# EAGLE design gameboy-pocket (EAGLE 8.5.0)
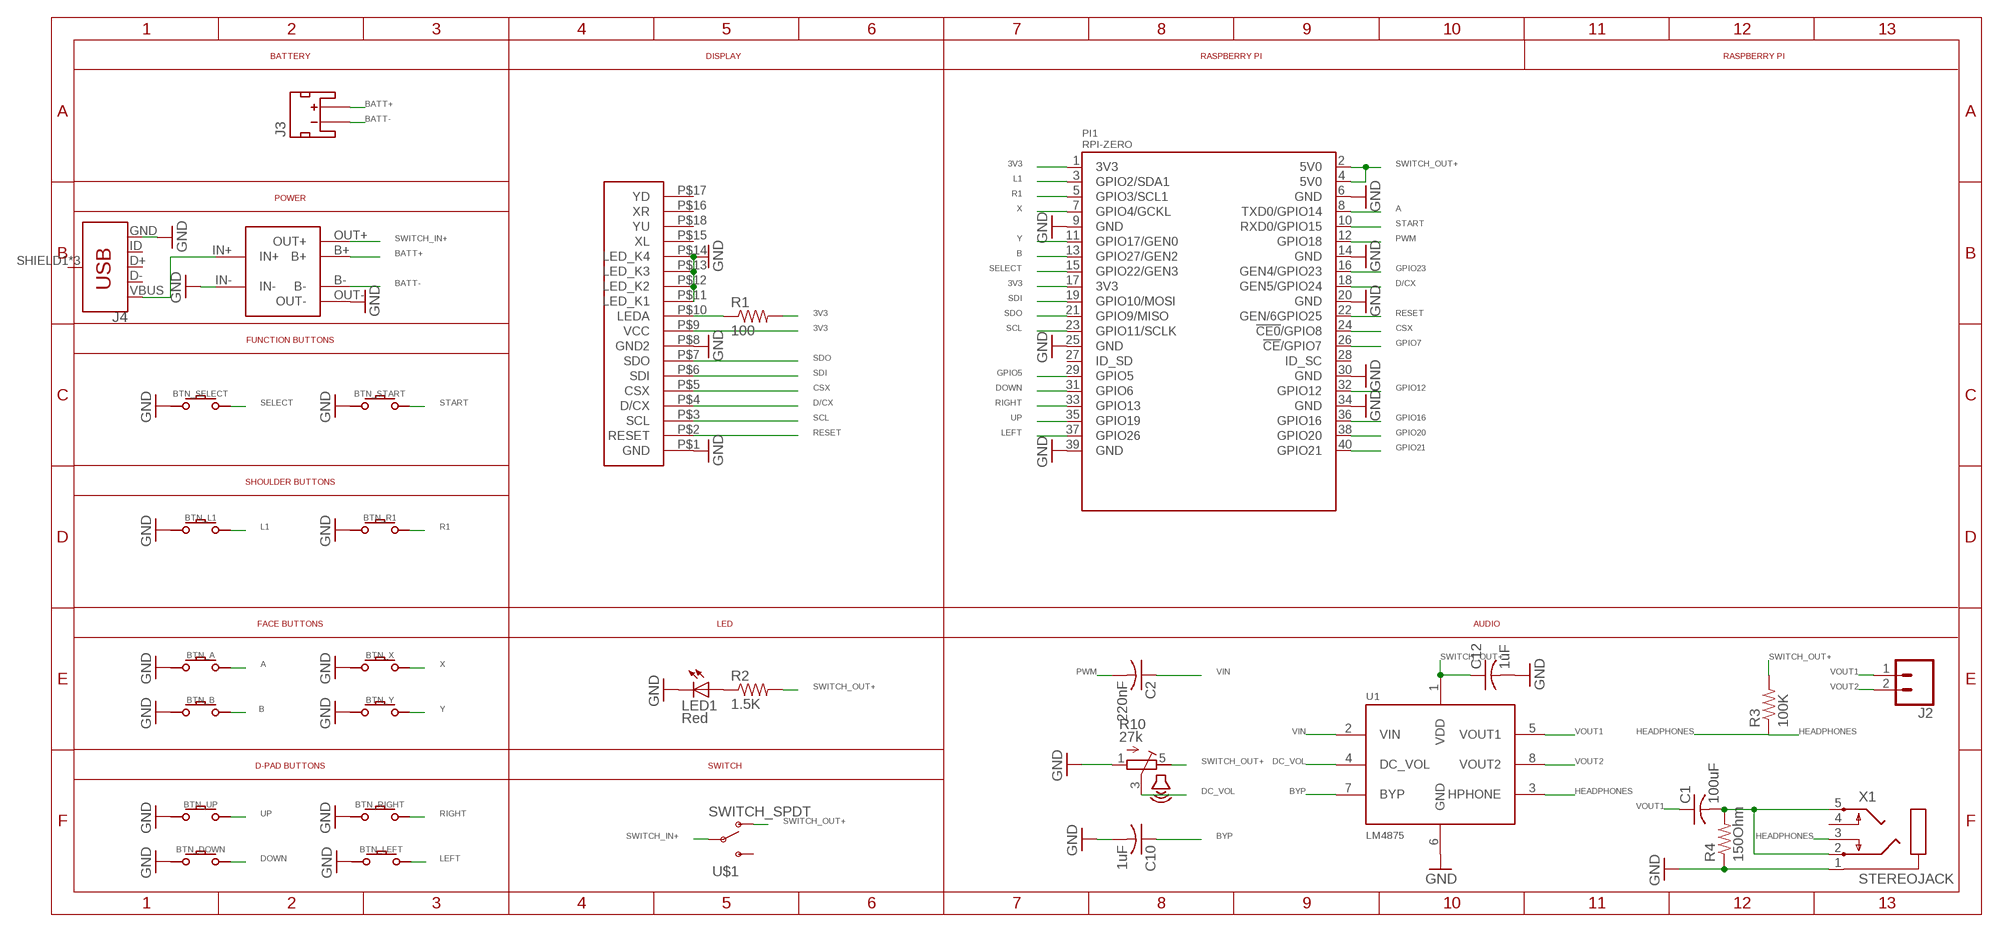
[diagram p0: schematic, sheet 1]

## Parts
2.4"TFT-ILI9341  GAMEBOYZEROHANDHELDDISPLAYS-2.4  [GAMEBOYZEROHANDHELDDISPLAYS-2.4]
BTN_A  GAMEBOY-ZERO-BUTTON  [GAMEBOY-ZERO-BUTTON]
BTN_B  GAMEBOY-ZERO-BUTTON  [GAMEBOY-ZERO-BUTTON]
BTN_DOWN  GAMEBOY-ZERO-BUTTON  [GAMEBOY-ZERO-BUTTON]
BTN_L1  GAMEBOY-ZERO-BUTTON  [GAMEBOY-ZERO-BUTTON]
BTN_LEFT  GAMEBOY-ZERO-BUTTON  [GAMEBOY-ZERO-BUTTON]
BTN_R1  GAMEBOY-ZERO-BUTTON  [GAMEBOY-ZERO-BUTTON]
BTN_RIGHT  GAMEBOY-ZERO-BUTTON  [GAMEBOY-ZERO-BUTTON]
BTN_SELECT  GAMEBOY-ZERO-BUTTON  [GAMEBOY-ZERO-BUTTON]
BTN_START  GAMEBOY-ZERO-BUTTON  [GAMEBOY-ZERO-BUTTON]
BTN_UP  GAMEBOY-ZERO-BUTTON  [GAMEBOY-ZERO-BUTTON]
BTN_X  GAMEBOY-ZERO-BUTTON  [GAMEBOY-ZERO-BUTTON]
BTN_Y  GAMEBOY-ZERO-BUTTON  [GAMEBOY-ZERO-BUTTON]
C1  100uF  C-USC0805  [C0805]
C2  220nF  C-USC0805  [C0805]
C10  1uF  C-USC0805  [C0805]
C12  1uF  C-USC0805  [C0805]
J2  CONN_02  [1X02]
J3  JST_2MM_MALE  [JST-2-SMD]
J4  USB_MICRO-B_FEMALE-SMT  [USB-B-MICRO-SMD]
LED1  Red  LEDCHIPLED_0805  [CHIPLED_0805]
PI1  RPI-ZERO  [RASPBERRYPI_BASTELSTUBE_V13_RASPI_BOARD_B+_FULL]
POWER1  03962A  [03962A]
R1  100  R-US_R0805  [R0805]
R2  1.5K  R-US_R0805  [R0805]
R3  100K  R-US_R0805  [R0805]
R4  150Ohm  R-US_R0805  [R0805]
R10  27k  VOLUME  [VOLUME]
U1  LM4875  [SOIC8]
U$1  SWITCH_SPDT  [KPS-1290]
X1  STEREOJACK  [STX3100]

## Nets
3V3: 2.4"TFT-ILI9341.P$9(VCC) PI1.1(3V3) PI1.17(3V3) R1.2
3V3100OHM: 2.4"TFT-ILI9341.P$10(LEDA) R1.1
A: BTN_A.P$ACTIVE PI1.8(TXD0/GPIO14)
B: BTN_B.P$ACTIVE PI1.13(GPIO27/GEN2)
BATT+: J3.2(+) POWER1.B+
BATT-: J3.1(-) POWER1.B-
BYP: C10.1 U1.7(BYP)
CSX: 2.4"TFT-ILI9341.P$5(CSX) PI1.24(!CE0!/GPIO8)
D/CX: 2.4"TFT-ILI9341.P$4(D/CX) PI1.18(GEN5/GPIO24)
DC_VOL: R10.3(S) U1.4(DC_VOL)
DOWN: BTN_DOWN.P$ACTIVE PI1.31(GPIO6)
GND: 2.4"TFT-ILI9341.P$1(GND) 2.4"TFT-ILI9341.P$8(GND2) 2.4"TFT-ILI9341.P$11(LED_K1) 2.4"TFT-ILI9341.P$12(LED_K2) 2.4"TFT-ILI9341.P$13(LED_K3) 2.4"TFT-ILI9341.P$14(LED_K4) BTN_A.P$GND BTN_B.P$GND BTN_DOWN.P$GND BTN_L1.P$GND BTN_LEFT.P$GND BTN_R1.P$GND BTN_RIGHT.P$GND BTN_SELECT.P$GND BTN_START.P$GND BTN_UP.P$GND BTN_X.P$GND BTN_Y.P$GND C10.2 C12.2 J4.GND LED1.C PI1.6(GND) PI1.9(GND) PI1.14(GND) PI1.20(GND) PI1.25(GND) PI1.30(GND) PI1.34(GND) PI1.39(GND) POWER1.IN- POWER1.OUT- R4.1 R10.1(A) U1.6(GND) X1.1
GPIO5: PI1.29(GPIO5)
GPIO7: PI1.26(!CE!/GPIO7)
GPIO12: PI1.32(GPIO12)
GPIO16: PI1.36(GPIO16)
GPIO20: PI1.38(GPIO20)
GPIO21: PI1.40(GPIO21)
GPIO23: PI1.16(GEN4/GPIO23)
HEADPHONES: R3.1 U1.3(HPHONE) X1.3
L1: BTN_L1.P$ACTIVE PI1.3(GPIO2/SDA1)
LED: LED1.A R2.1
LEFT: BTN_LEFT.P$ACTIVE PI1.37(GPIO26)
PWM: C2.2 PI1.12(GPIO18)
R1: BTN_R1.P$ACTIVE PI1.5(GPIO3/SCL1)
RESET: 2.4"TFT-ILI9341.P$2(RESET) PI1.22(GEN/6GPIO25)
RIGHT: BTN_RIGHT.P$ACTIVE PI1.33(GPIO13)
SCL: 2.4"TFT-ILI9341.P$3(SCL) PI1.23(GPIO11/SCLK)
SDI: 2.4"TFT-ILI9341.P$6(SDI) PI1.19(GPIO10/MOSI)
SDO: 2.4"TFT-ILI9341.P$7(SDO) PI1.21(GPIO9/MISO)
SELECT: BTN_SELECT.P$ACTIVE PI1.15(GPIO22/GEN3)
START: BTN_START.P$ACTIVE PI1.10(RXD0/GPIO15)
SWITCH_IN+: POWER1.OUT+ U$1.P
SWITCH_OUT+: C12.1 PI1.2(5V0) PI1.4(5V0) R2.2 R3.2 R10.5(E) U1.1(VDD) U$1.O
UP: BTN_UP.P$ACTIVE PI1.35(GPIO19)
VIN: C2.1 U1.2(VIN)
VIN1: C1.2 R4.2 X1.2 X1.5
VOUT1: C1.1 J2.1 U1.5(VOUT1)
VOUT2: J2.2 U1.8(VOUT2)
VUSB: J4.VBUS POWER1.IN+
X: BTN_X.P$ACTIVE PI1.7(GPIO4/GCKL)
Y: BTN_Y.P$ACTIVE PI1.11(GPIO17/GEN0)
Unconnected: 2.4"TFT-ILI9341.P$15(XL) 2.4"TFT-ILI9341.P$16(XR) 2.4"TFT-ILI9341.P$17(YD) 2.4"TFT-ILI9341.P$18(YU) J3.NC1(PAD1) J3.NC2(PAD2) J4.D+ J4.D- J4.ID J4.SHIELD1(SHIELD) J4.SHIELD2(SHIELD) J4.SHIELD3(SHIELD) PI1.27(ID_SD) PI1.28(ID_SC) U$1.S X1.4

## Notes on the sheet
- BATTERY | DISPLAY | RASPBERRY PI | RASPBERRY PI
- POWER
- FUNCTION BUTTONS
- SHOULDER BUTTONS
- FACE BUTTONS | LED | AUDIO
- D-PAD BUTTONS | SWITCH

## Library data of the parts
2.4"TFT-ILI9341 = GameboyZeroHandheldDisplays:GAMEBOYZEROHANDHELDDISPLAYS-2.4
BTN_A BTN_B BTN_DOWN BTN_L1 BTN_LEFT BTN_R1 BTN_RIGHT BTN_SELECT BTN_START BTN_UP BTN_X BTN_Y = GameboyZeroButtonLibrary:GAMEBOY-ZERO-BUTTON
C1 C2 C10 C12 = adafruit:C-US: CAPACITOR, American symbol
J2 = SparkFun-Connectors:CONN_02: Multi connection point. Often used as Generic Header-pin footprint for 0.1 inch spaced/style header connections On any of the 0.1 inch spaced packages, you can populate with these: Break Away Headers - Straight <https://www.sparkfun.com/products/116> (PRT-00116) Break Away Male Headers - Right Angle <https://www.sparkfun.com/products/553> (PRT-00553) Female Headers <https://www.sparkfun.com/products/115> (PRT-00115) Break Away Headers - Machine Pin <https://www.sparkfun.com/products/117> (PRT-00117) Break Away Female Headers - Swiss Machine Pin <https://www.sparkfun.com/products/743> (PRT-00743) For SCREWTERMINALS and SPRING TERMINALS visit here: Screw Terimnals on SparkFun.com <https://www.sparkfun.com/search/results?term=Screw+Terminals> (5mm/3.5mm/2.54mm spacing) This device is also useful as a general connection point to wire up your design to another part of your project. Our various solder wires solder well into these plated through hole pads. Hook-Up Wire - Assortment (Stranded, 22 AWG) <https://www.sparkfun.com/products/11375> (PRT-11375) Hook-Up Wire - Assortment (Solid Core, 22 AWG) <https://www.sparkfun.com/products/11367> (PRT-11367) View the entire wire category on our website here <https://www.sparkfun.com/categories/141> Special notes: Molex polarized connector foot print use with: PRT-08233 with associated crimp pins and housings. 2.54_SCREWTERM for use with PRT-10571. 3.5mm Screw Terminal footprints for PRT-08084 5mm Screw Terminal footprints for use with PRT-08432
J3 = SparkFun-Connectors:JST_2MM_MALE: Mates to single-cell LiPo batteries. CONN-11443 Now with smashable polarity marks!; BTM_NEG: -; BTM_POS: +; PROD_ID: CONN-11443; TOP_NEG: -; TOP_POS: +
J4 = SparkFun-Connectors:USB_MICRO-B: USB Type Micro-B Connector Male/female and PTH/SMT variants SparkFun Products: SparkFun microB USB Breakout <https://www.sparkfun.com/products/12035> SparkFun USB microB Plug Breakout <https://www.sparkfun.com/products/10031> SparkFun ESP8266 Thing <https://www.sparkfun.com/products/13231>; PROD_ID: CONN-11752
LED1 = adafruit:LED: LED OSRAM: - CHIPLED LG R971, LG N971, LY N971, LG Q971, LY Q971, LO R971, LY R971 LH N974, LH R974 LS Q976, LO Q976, LY Q976 LO Q996 - Hyper CHIPLED LW Q18S LB Q993, LB Q99A, LB R99A - SideLED LS A670, LO A670, LY A670, LG A670, LP A670 LB A673, LV A673, LT A673, LW A673 LH A674 LY A675 LS A676, LA A676, LO A676, LY A676, LW A676 LS A679, LY A679, LG A679 - Hyper Micro SIDELED® LS Y876, LA Y876, LO Y876, LY Y876 LT Y87S - SmartLED LW L88C, LW L88S LB L89C, LB L89S, LG L890 LS L89K, LO L89K, LY L89K LS L896, LA L896, LO L896, LY L896 - TOPLED LS T670, LO T670, LY T670, LG T670, LP T670 LSG T670, LSP T670, LSY T670, LOP T670, LYG T670 LG T671, LOG T671, LSG T671 LB T673, LV T673, LT T673, LW T673 LH T674 LS T676, LA T676, LO T676, LY T676, LB T676, LH T676, LSB T676, LW T676 LB T67C, LV T67C, LT T67C, LS T67K, LO T67K, LY T67K, LW E67C LS E67B, LA E67B, LO E67B, LY E67B, LB E67C, LV E67C, LT E67C LW T67C LS T679, LY T679, LG T679 LS T770, LO T770, LY T770, LG T770, LP T770 LB T773, LV T773, LT T773, LW T773 LH T774 LS E675, LA E675, LY E675, LS T675 LS T776, LA T776, LO T776, LY T776, LB T776 LHGB T686 LT T68C, LB T68C - Hyper Mini TOPLED® LB M676 - Mini TOPLED Santana® LG M470 LS M47K, LO M47K, LY M47K Source: http://www.osram.convergy.de/
PI1 = RPI-Zero:RPI-ZERO
POWER1 = 03962A:03962A
R1-R4 = adafruit:R-US_: RESISTOR, American symbol
R10 = GBA:VOLUME
U1 = texas:LM4875
U$1 = SparkFun-Retired:SWITCH_SPDT: SWCH-10651 Side-actuated SPDT slide switch, as used on the Arduino Pro; PROD_ID: SWCH-10651
X1 = adafruit:STEREOJACK: MIC/HEADPHONE JACK Stereo jack with two switches. Kycon STX3100, CUI SJ1-3555NG and/or 4UCon 05544

## Board
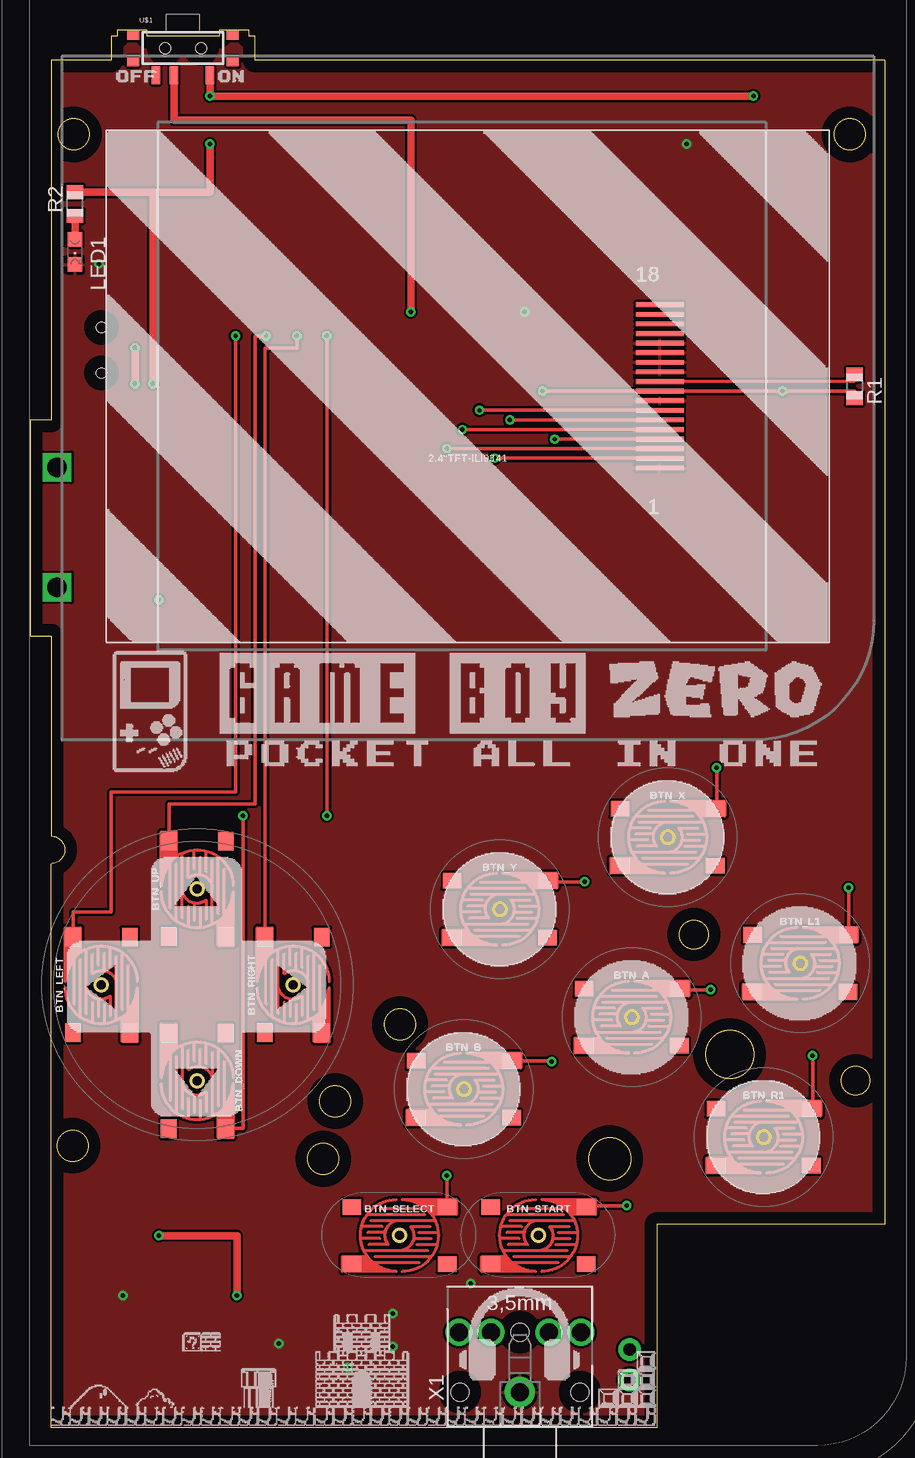
[diagram p1: board, top side]
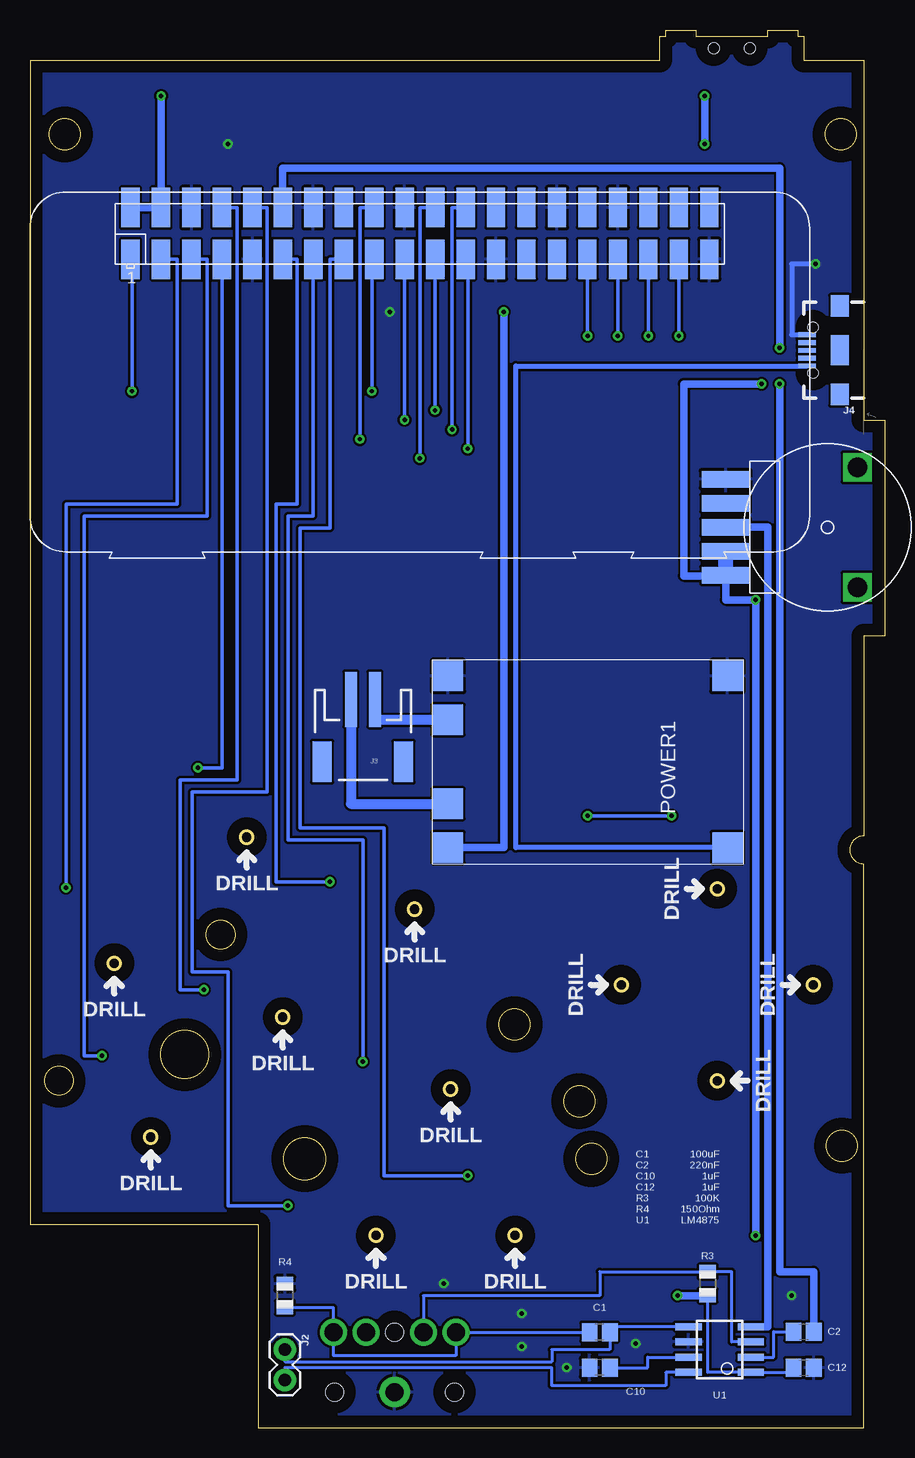
[diagram p2: board, bottom side, seen from below]

Size 71.25 x 116.5 mm. Coordinates in mm from the lower left corner, seen from the top.
Outline: 71.25,114 71.25,16.95 52.25,16.95 52.25,0 1.75,0 1.75,47 arc180 1.75,49.3 1.75,66 0,66 0,84 1.75,84 1.75,114 6.75,114 6.75,116 7.25,116 7.25,116.5 9.75,116.5 9.75,116 15.75,116 15.75,116.5 18.25,116.5 18.25,116 18.75,116 18.75,114 71.25,114
Outline: circle at 3.55,23.5 radius 1.3
Outline: circle at 68.85,28.9 radius 1.2
Outline: circle at 58.35,31.1 radius 2
Outline: circle at 48.35,22.4 radius 1.75
Outline: circle at 30.85,33.6 radius 1.3
Outline: circle at 25.45,27.2 radius 1.3
Outline: circle at 24.45,22.4 radius 1.3
Outline: circle at 55.35,41.1 radius 1.2
Outline: circle at 68.35,107.8 radius 1.3
Outline: circle at 3.65,107.8 radius 1.3
Copper layers (1*16): Top 0.035mm / dielectric 1.5mm / Bottom 0.035mm
Design rules "default *": minimum track width 10mil, minimum drill 24mil, track to track 8mil, track to pad 8mil, pad to pad 8mil, via to via 8mil, smd to smd 8mil, copper to edge 40mil, drill to drill 8mil, minimum pad ring 10mil, minimum via ring 8mil, stop-mask expansion 5mil, vias tented up to drill 10mil, thermal gap 10mil

### Footprints (pad centres in the part's own frame; a part is rotated, then mirrored left to right if it is on the bottom)
GAMEBOYZEROHANDHELDDISPLAYS-2.4 = smd 4 x 0.4: P$1 -16,6.8; P$2 -16,6; P$3 -16,5.2; P$4 -16,4.4; P$5 -16,3.6; P$6 -16,2.8; P$7 -16,2; P$8 -16,1.2; P$9 -16,0.4; P$10 -16,-0.4; P$11 -16,-1.2; P$12 -16,-2; P$13 -16,-2.8; P$14 -16,-3.6; P$15 -16,-4.4; P$16 -16,-5.2; P$17 -16,-6; P$18 -16,-6.8
GAMEBOY-ZERO-BUTTON = smd 1.55 x 1.3: P$ACTIVE 3.975,2.365; P$GND -3.975,-2.385; P$NC -3.975,2.365; P$NC2 3.975,-2.385 | hole 1: 0,0
C0805 = smd 1.3 x 1.5: 1 -0.85,0; 2 0.85,0
1X02 = drill 1.016 pad 1.88: 1 0,0; 2 2.54,0
JST-2-SMD = smd 1 x 4.6: 1 -1,-3.7; 2 1,-3.7 | smd 1.6 x 3.4: NC1 -3.4,1.5; NC2 3.4,1.5
USB-B-MICRO-SMD = smd 1.45 x 0.4: D+ 2.725,0; D- 2.725,0.65; GND 2.725,-1.3; ID 2.725,-0.65; VBUS 2.725,1.3 | smd 1.5 x 1.8: SHIELD1 0,3.685; SHIELD2 0,-3.685 | smd 1.5 x 2.5: SHIELD3 0,0 | hole 0.85: 2.2,1.9; 2.2,-1.9
CHIPLED_0805 = smd 1.2 x 1.2: A 0,-1.05; C 0,1.05
RASPBERRYPI_BASTELSTUBE_V13_RASPI_BOARD_B+_FULL = smd 1.524 x 3.302: 1 8.382,24.384; 2 8.382,28.702; 3 10.922,24.384; 4 10.922,28.702; 5 13.462,24.384; 6 13.462,28.702; 7 16.002,24.384; 8 16.002,28.702; 9 18.542,24.384; 10 18.542,28.702; 11 21.082,24.384; 12 21.082,28.702; 13 23.622,24.384; 14 23.622,28.702; 15 26.162,24.384; 16 26.162,28.702; 17 28.702,24.384; 18 28.702,28.702; 19 31.242,24.384; 20 31.242,28.702; 21 33.782,24.384; 22 33.782,28.702; 23 36.322,24.384; 24 36.322,28.702; 25 38.862,24.384; 26 38.862,28.702; 27 41.402,24.384; 28 41.402,28.702; 29 43.942,24.384; 30 43.942,28.702; 31 46.482,24.384; 32 46.482,28.702; 33 49.022,24.384; 34 49.022,28.702; 35 51.562,24.384; 36 51.562,28.702; 37 54.102,24.384; 38 54.102,28.702; 39 56.642,24.384; 40 56.642,28.702
03962A = smd 2.54 x 2.54: B+ 12,1.35; B- 5,1.35; IN+ 15.65,24.65; IN- 1.35,24.65; OUT+ 15.65,1.35; OUT- 1.35,1.35
R0805 = smd 1.1 x 1.4: 1 -1,0; 2 1,0
VOLUME = smd 1.4 x 4: 1 -4,-2; 2 -2,-2; 3 0,-2; 4 2,-2; 5 4,-2 | drill 1.6 square: P$6 -5,9; P$7 5,9
SOIC8 = smd 0.6 x 2.2: 1 -1.905,-2.6; 2 -0.635,-2.6; 3 0.635,-2.6; 4 1.905,-2.6; 5 1.905,2.6; 6 0.635,2.6; 7 -0.635,2.6; 8 -1.905,2.6
KPS-1290 = smd 0.7 x 1.5: O -2.25,2.25; P 0.75,2.25; S 2.25,2.25 | smd 1 x 0.8: P$1 -4.15,1.1; P$2 -4.15,-1.1; P$3 4.15,-1.1; P$4 4.15,1.1 | hole 0.9: -1.5,0; 1.5,0
STX3100 = drill 1.5 pad 2.54: 1 2.7,-0.1 | drill 1.5: 2 7.7,5; 3 7.7,2.3; 4 7.7,-2.5; 5 7.7,-5.2 | hole 1.5: 2.7,4.9; 2.7,-5.1; 7.7,-0.1

### Placement (x,y rotation side)
2.4"TFT-ILI9341  36.5,86.8 180 top
BTN_A  50.17,34.21 0 top
BTN_B  36.17,28.21 0 top
BTN_DOWN  13.95,28.9 270 top
BTN_L1  64.22,38.7 0 top
BTN_LEFT  5.95,36.9 90 top
BTN_R1  61.17,24.21 0 top
BTN_RIGHT  21.95,36.9 90 top
BTN_SELECT  30.8,16.01 0 top
BTN_START  42.41,16.01 0 top
BTN_UP  13.95,44.9 90 top
BTN_X  53.17,49.21 0 top
BTN_Y  39.17,43.21 0 top
C1  23.75,7.95 180 bottom
C2  6.75,8 0 bottom
C10  23.75,5 180 bottom
C12  6.75,5 0 bottom
J2  50,6.5 270 bottom
J3  43.5,57 180 bottom
J4  3.75,89.8 180 bottom
LED1  3.75,98 180 top
PI1  71.25,73 0 bottom
POWER1  37.75,64 270 bottom
R1  68.75,86.8 270 top
R2  3.75,102 90 top
R3  14.75,12 270 bottom
R4  50,11 270 bottom
R10  11.25,75.05 270 bottom
U1  13.75,6.5 90 bottom
U$1  12.75,115 180 top
X1  40.75,0.25 90 top

### Tracks (layer width: path | path; a pad name or v marks a point on that pad's centre or on a via)
3V3  (via drill 0.35)
  Top 0.305: R1.2 68.75,86.4 v62.75,86.4 2.4"TFT-ILI9341.P$9 v42.75,86.4
  Bottom 0.305: PI1.17 42.75,97.38 v42.75,86.4 | PI1.1 62.75,97.38 v62.75,86.4
3V3100OHM
  Top 0.254: R1.1 68.75,87.2 2.4"TFT-ILI9341.P$10
A  (via drill 0.35)
  Top 0.305: v56.75,36.5 54.15,36.5 BTN_A.P$ACTIVE
  Bottom 0.305: PI1.8 54,101.7 54,77 54,54 58.75,54 58.75,36.5 v56.75,36.5
B  (via drill 0.35)
  Top 0.305: v43.5,30.5 43.5,30.57 BTN_B.P$ACTIVE
  Bottom 0.305: PI1.13 47.63,76 49.75,76 49.75,49 43.5,49 v43.5,30.5
BATT+
  Bottom 0.813: J3.2 44.5,52 POWER1.B+
BATT-
  Bottom 0.813: POWER1.B- 42.5,59 J3.1
BYP
  Bottom 0.254: C10.1 19.75,5 19.75,5.87 U1.7
CSX  (via drill 0.35)
  Top 0.305: v36.05,83.2 2.4"TFT-ILI9341.P$5
  Bottom 0.305: PI1.24 36.05,101.7 v36.05,83.2
D/CX  (via drill 0.35)
  Top 0.305: v43.75,82.4 2.4"TFT-ILI9341.P$4
  Bottom 0.305: PI1.18 43.75,101.7 v43.75,82.4
DC_VOL
  Bottom 0.61: U1.4 9.75,8.4 9.75,75.05 R10.3
DOWN  (via drill 0.35)
  Top 0.305: BTN_DOWN.P$ACTIVE 17.75,24.93 v17.75,51 | v24.75,91 v24.75,51
  Bottom 0.305: v17.75,51 v24.75,51 24.77,51 | PI1.31 24.77,91 v24.75,91
GND  (via drill 0.35)
  Bottom 0.406: v5.75,97 7.75,97 7.75,91.1 J4.GND
  other vias: 41.25,93 36.75,12 30.25,9.5 30.25,6.75 7.75,11 54.75,107 26.5,5 20.75,7
  pour Top: 1.75,0 52.25,0 52.25,16.95 71.25,16.95 71.25,114 18.75,114 18.75,116 18.25,116 18.25,116.5 15.75,116.5 15.75,116 9.75,116 9.75,116.5 7.25,116.5 7.25,116 6.75,116 6.75,114 1.75,114 1.75,84 0,84 0,66 1.75,66
  pour Bottom: 1.75,0 52.25,0 52.25,16.95 71.25,16.95 71.25,114 18.75,114 18.75,116 18.25,116 18.25,116.5 15.75,116.5 15.75,116 9.75,116 9.75,116.5 7.25,116.5 7.25,116 6.75,116 6.75,114 1.75,114 1.75,84 0,84 0,66 1.75,66
HEADPHONES
  Bottom 0.254: X1.3 38.45,11 23.75,11 23.75,13 R3.1 12.75,13 12.75,7.13 U1.3
L1  (via drill 0.35)
  Top 0.305: v68.25,45 68.25,41.06 BTN_L1.P$ACTIVE
  Bottom 0.305: PI1.3 59,97.38 59,77 68.25,77 v68.25,45
LED
  Top 0.61: R2.1 LED1.A
LEFT  (via drill 0.35)
  Top 0.305: BTN_LEFT.P$ACTIVE 3.58,43 6.75,43 6.75,53 17.15,53 v17.15,91
  Bottom 0.305: PI1.37 v17.15,91
PWM  (via drill 0.35)
  Top 0.61: v8.75,90 v8.75,87
  Bottom 0.61: PI1.12 50.17,105 8.75,105 v8.75,90 | v8.75,87 8.75,13 5.9,13 C2.2
R1  (via drill 0.35)
  Top 0.305: v65.25,31 65.25,26.57 BTN_R1.P$ACTIVE
  Bottom 0.305: PI1.5 56.5,97.38 56.5,76 66.75,76 66.75,31 v65.25,31
RESET  (via drill 0.35)
  Top 0.305: v38.75,80.8 2.4"TFT-ILI9341.P$2
  Bottom 0.305: PI1.22 38.75,101.7 v38.75,80.8
RIGHT  (via drill 0.35)
  Top 0.305: BTN_RIGHT.P$ACTIVE 19.59,90 22.25,90 v22.25,91
  Bottom 0.305: v22.25,91 22.25,97.38 PI1.33
SCL  (via drill 0.35)
  Top 0.305: v34.75,81.6 2.4"TFT-ILI9341.P$3
  Bottom 0.305: PI1.23 34.75,97.38 v34.75,81.6 34.75,82
SDI  (via drill 0.35)
  Top 0.305: v40.01,84 2.4"TFT-ILI9341.P$6
  Bottom 0.305: PI1.19 v40.01,84
SDO  (via drill 0.35)
  Top 0.305: v37.47,84.8 2.4"TFT-ILI9341.P$7
  Bottom 0.305: PI1.21 v37.47,84.8
SELECT  (via drill 0.35)
  Top 0.305: BTN_SELECT.P$ACTIVE 34.75,18.38 v34.75,21
  Bottom 0.305: PI1.15 46.25,97.38 46.25,75 48.75,75 48.75,50 41.75,50 41.75,21 v34.75,21
START  (via drill 0.35)
  Top 0.305: v49.75,18.5 46.38,18.5 BTN_START.P$ACTIVE
  Bottom 0.305: PI1.10 51.5,101.7 51.5,53 57.75,53 57.75,38 54.75,38 54.75,18.5 v49.75,18.5
SWITCH_IN+  (via drill 0.35)
  Top 0.61: v31.75,93 31.75,109 12,109 U$1.P
  Bottom 0.61: POWER1.OUT+ 31.75,48.35 v31.75,93
SWITCH_OUT+  (via drill 0.35)
  Top 0.61: U$1.O v15,111 v60.33,111 | R2.2 10.25,103 | 10.25,103 15,103 v15,107 | v10.25,87 10.25,103 | v17.25,11 17.25,16 v10.75,16
  Bottom 0.254: R3.2 14.75,4.59 U1.1 7.6,4.59 C12.1
  Bottom 0.61: PI1.2 PI1.4 v60.33,111 | v15,107 v15,111 | v10.75,16 v10.75,69 13.25,69 R10.5 12.75,71.05 12.75,71 16.75,71 16.75,87 v10.25,87 | R3.2 v17.25,11
  Bottom 1.27: R10.5 13.25,73 12.75,73
UP  (via drill 0.35)
  Top 0.305: BTN_UP.P$ACTIVE 11.59,52 18.75,52 18.75,91 v19.69,91
  Bottom 0.305: PI1.35 v19.69,91
VIN
  Bottom 0.254: U1.2 9.25,5.87 9.25,8 C2.1
VIN1
  Bottom 0.254: C1.2 X1.2 35.75,6 45.95,6 X1.5 45.95,10 R4.2
VOUT1
  Bottom 0.254: J2.1 50,5.5 27.75,5.5 27.75,6.5 22.9,6.5 C1.1 22.9,8.4 U1.5
VOUT2
  Bottom 0.254: U1.8 18.25,4.59 18.25,3.5 27.75,3.5 27.75,5 50,5 J2.2
VUSB
  Bottom 0.406: POWER1.IN+ 30.75,48.35 30.75,88.5 J4.VBUS
X  (via drill 0.35)
  Top 0.305: v57.25,55 57.25,51.58 BTN_X.P$ACTIVE
  Bottom 0.305: v57.25,55 55.25,55 PI1.7
Y  (via drill 0.35)
  Top 0.305: v46.25,45.5 43.15,45.5 BTN_Y.P$ACTIVE
  Bottom 0.305: PI1.11 49,97.38 49,77 50.75,77 50.75,46 50.75,45.5 v46.25,45.5

### Text on the board
bPlace: 100uF / 220nF / 1uF / 1uF / 100K / 150Ohm / LM4875 | C1 / C2 / C10 / C12 / R3 / R4 / U1 | R3 | R4 | C1 | C2 | C12 | U1 | C10